# EAGLE schematic Control (EAGLE 9.5.2)

## Sheet 1 of 6
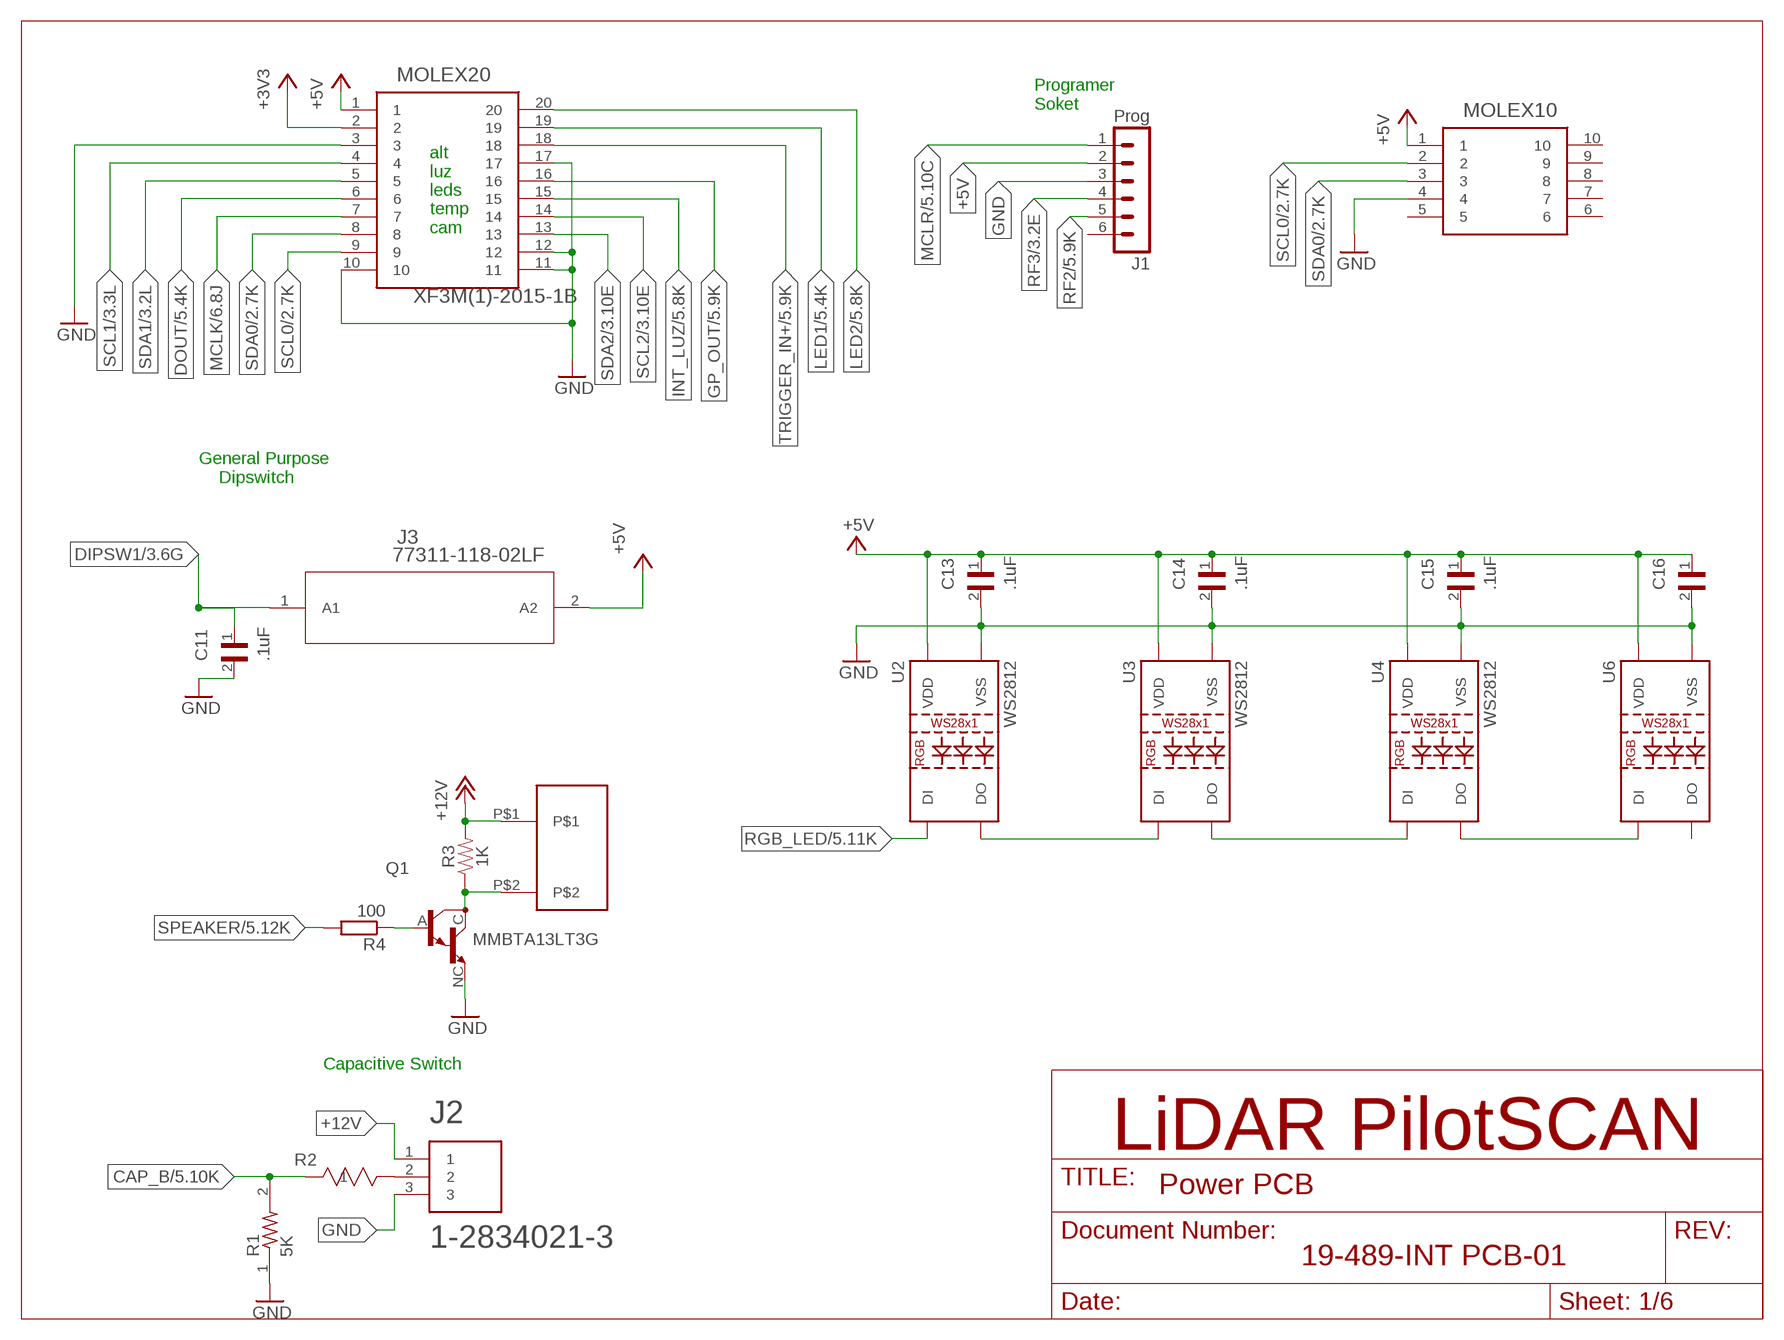
[diagram p0: schematic, sheet 1]

### Parts
BUZZ1  PS1240P02BT  [PS1240P02BT]
C11  .1uF  08056C104JAZ2A  [CAPC2012X140N]
C13  .1uF  08056C104JAZ2A  [CAPC2012X140N]
C14  .1uF  08056C104JAZ2A  [CAPC2012X140N]
C15  .1uF  08056C104JAZ2A  [CAPC2012X140N]
C16  .1uF  08056C104JAZ2A  [CAPC2012X140N]
J1  Prog  MA06-1  [MA06-1]
J2  1-2834021-3  [CONN_1-2834021-3]
J3  77311-118-02LF  [77311-118-02LF]
MOLEX10  522071060  [522071060]
MOLEX20  XF3M(1)-2015-1B  [XF3M(1)-2015-1B]
Q1  MMBTA13LT3G  [MMBTA13LT3G]
R1  5K  CRCW08055K00FKTA  [RESC2012X60]
R2  6K8  RC0201FR-076K8L  [RES_RC0201_P6XP3]
R3  1K  10MOHM-HORIZ-1/4W-5%  [AXIAL-0.3]
R4  100  RMCF0805JT270R  [RMCF0805JT270R]
U2  WS2812  WS2812"  [LED-TRICOLOR-5050-IC]
U3  WS2812  WS2812"  [LED-TRICOLOR-5050-IC]
U4  WS2812  WS2812"  [LED-TRICOLOR-5050-IC]
U6  WS2812  WS2812"  [LED-TRICOLOR-5050-IC]

### Nets
+3V3: MOLEX20.2 ; also sheet 2,3,5
+5V [power]: C13.1 C14.1 C15.1 C16.1 J1.2 J3.2(A2) MOLEX10.1 MOLEX20.1 U2.3(VDD) U2.5(VDD) U3.3(VDD) U3.5(VDD) U4.3(VDD) U4.5(VDD) U6.3(VDD) U6.5(VDD) ; also sheet 2,3,4,5,6
+12V: BUZZ1.P$1 J2.1 R3.P$2 ; also sheet 2
CAP_B: R1.2 R2.1 ; also sheet 5
DIPSW1: C11.1 J3.1(A1) ; also sheet 3
DOUT: MOLEX20.6 ; also sheet 5
GND: C11.2 C13.2 C14.2 C15.2 C16.2 J1.3 J2.3 MOLEX10.4 MOLEX20.3 MOLEX20.10 MOLEX20.11 MOLEX20.12 MOLEX20.17 Q1.NC(E) R1.1 U2.6(VSS) U3.6(VSS) U4.6(VSS) U6.6(VSS) ; also sheet 2,3,4,5,6
GP_OUT: MOLEX20.16 ; also sheet 5
INT_LUZ: MOLEX20.15 ; also sheet 5
LED1: MOLEX20.19 ; also sheet 5
LED2: MOLEX20.20 ; also sheet 5
MCLK: MOLEX20.7 ; also sheet 6
MCLR: J1.1 ; also sheet 5
N$7: Q1.A(B) R4.1
N$8: BUZZ1.P$2 Q1.C R3.P$1
N$10: J2.2 R2.2
N$47: U2.1(DO) U3.2(DI)
N$48: U3.1(DO) U4.2(DI)
N$49: U4.1(DO) U6.2(DI)
RF2: J1.5 ; also sheet 3,5
RF3: J1.4 ; also sheet 3,5
RGB_LED: U2.2(DI) ; also sheet 5
SCL0: MOLEX10.2 MOLEX20.9 ; also sheet 2,3
SCL1: MOLEX20.4 ; also sheet 3
SCL2: MOLEX20.14 ; also sheet 3
SDA0: MOLEX10.3 MOLEX20.8 ; also sheet 2,3
SDA1: MOLEX20.5 ; also sheet 3
SDA2: MOLEX20.13 ; also sheet 3
SPEAKER: R4.2 ; also sheet 5
TRIGGER_IN+: MOLEX20.18 ; also sheet 5
Unconnected: J1.6 MOLEX10.5 MOLEX10.6 MOLEX10.7 MOLEX10.8 MOLEX10.9 MOLEX10.10 U6.1(DO)

### Notes on the sheet
- Programer
  Soket
- alt
  luz
  leds
  temp
  cam
- General Purpose
      Dipswitch
- Capacitive Switch

## Sheet 2 of 6
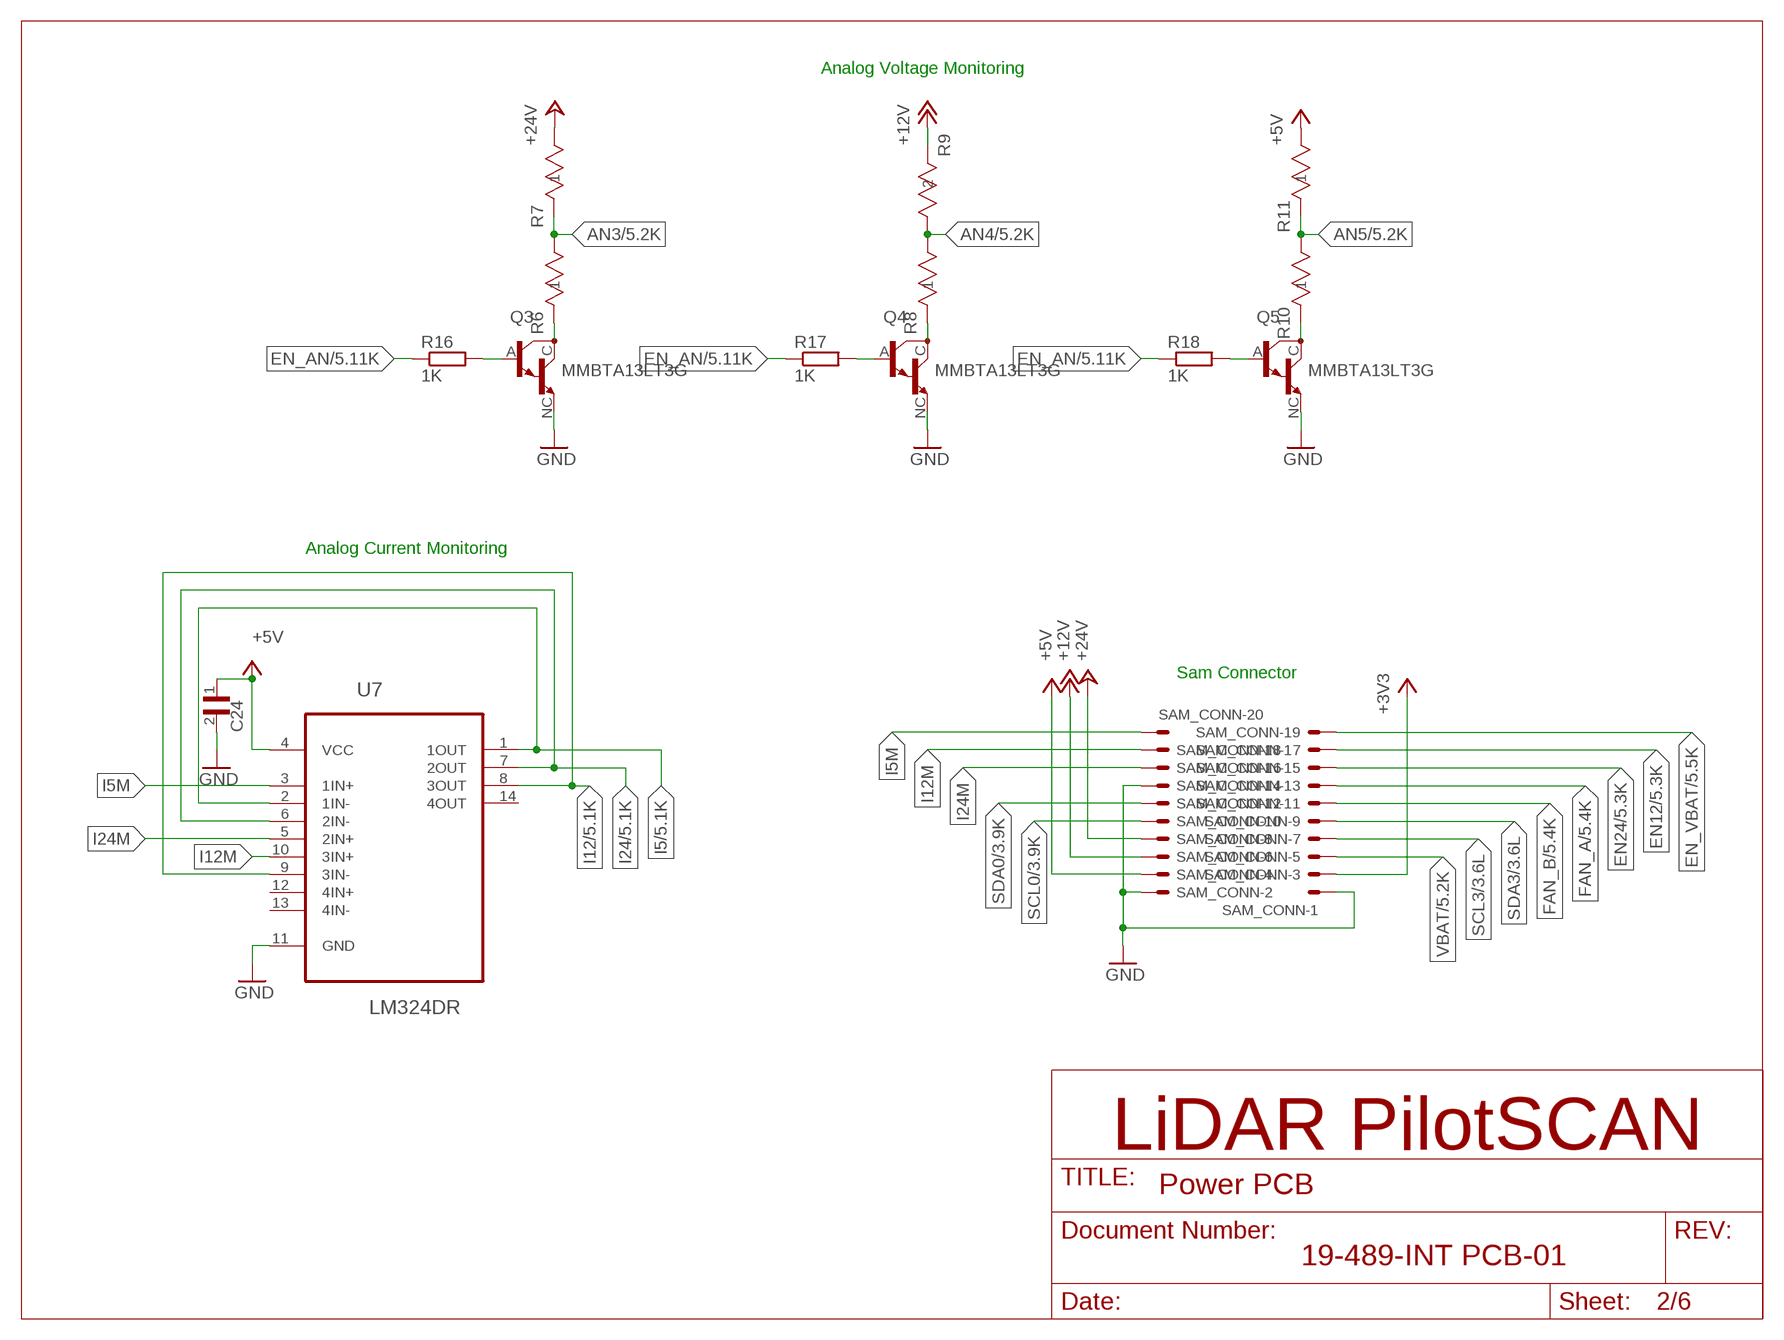
[diagram p1: schematic, sheet 2]

### Parts
C24  08056C104JAZ2A  [CAPC2012X140N]
Q3  MMBTA13LT3G  [MMBTA13LT3G]
Q4  MMBTA13LT3G  [MMBTA13LT3G]
Q5  MMBTA13LT3G  [MMBTA13LT3G]
R6  1K8  RC0201JR-071K8L  [RES_RC0201_P6XP3]
R7  18K  RC0201JR-071K8L  [RES_RC0201_P6XP3]
R8  1K8  RC0201JR-071K8L  [RES_RC0201_P6XP3]
R9  8K2  CRG0805F8K2RES0805_CRG_TYCO-L  [RES0805_CRG_TYCO-L]
R10  1K8  RC0201JR-071K8L  [RES_RC0201_P6XP3]
R11  1K5  RC0201JR-071K5L  [YAG_R0201]
R16  1K  RMCF0805FT1K00  [RMCF0805FT1K00]
R17  1K  RMCF0805FT1K00  [RMCF0805FT1K00]
R18  1K  RMCF0805FT1K00  [RMCF0805FT1K00]
SAM_CONN  IPT1-110-01-L-D  [IPT1-110-01-L-D]
U7  LM324DR  [SOIC127P600X175-14N]

### Nets
+3V3: SAM_CONN.P$3 ; also sheet 1,3,5
+5V [power]: C24.1 R11.2 SAM_CONN.P$4 U7.4(VCC) ; also sheet 1,3,4,5,6
+12V: R9.2 SAM_CONN.P$6 ; also sheet 1
+24V: R7.2 SAM_CONN.P$8
AN3: R6.2 R7.1 ; also sheet 5
AN4: R8.2 R9.1 ; also sheet 5
AN5: R10.2 R11.1 ; also sheet 5
EN12: SAM_CONN.P$17 ; also sheet 5
EN24: SAM_CONN.P$15 ; also sheet 5
EN_AN: R16.1 R17.1 R18.1 ; also sheet 5
EN_VBAT: SAM_CONN.P$19 ; also sheet 5
ESRDTFYGHUJI: Q4.C R8.1
FAN_A: SAM_CONN.P$13 ; also sheet 5
FAN_B: SAM_CONN.P$11 ; also sheet 5
GND: C24.2 Q3.NC(E) Q4.NC(E) Q5.NC(E) SAM_CONN.P$1 SAM_CONN.P$2 SAM_CONN.P$14 U7.11(GND) ; also sheet 1,3,4,5,6
I5: U7.1(1OUT) U7.2(1IN-) ; also sheet 5
I5M: SAM_CONN.P$20 U7.3(1IN+)
I12: U7.8(3OUT) U7.9(3IN-) ; also sheet 5
I12M: SAM_CONN.P$18 U7.10(3IN+)
I24: U7.6(2IN-) U7.7(2OUT) ; also sheet 5
I24M: SAM_CONN.P$16 U7.5(2IN+)
N$11: Q3.A(B) R16.2
N$37: Q3.C R6.1
N$38: Q4.A(B) R17.2
N$39: Q5.C R10.1
N$40: Q5.A(B) R18.2
SCL0: SAM_CONN.P$10 ; also sheet 1,3
SCL3: SAM_CONN.P$7 ; also sheet 3
SDA0: SAM_CONN.P$12 ; also sheet 1,3
SDA3: SAM_CONN.P$9 ; also sheet 3
VBAT: SAM_CONN.P$5 ; also sheet 5
Unconnected: U7.12(4IN+) U7.13(4IN-) U7.14(4OUT)

### Notes on the sheet
- Analog Voltage Monitoring
- Analog Current Monitoring
- Sam Connector

## Sheet 3 of 6
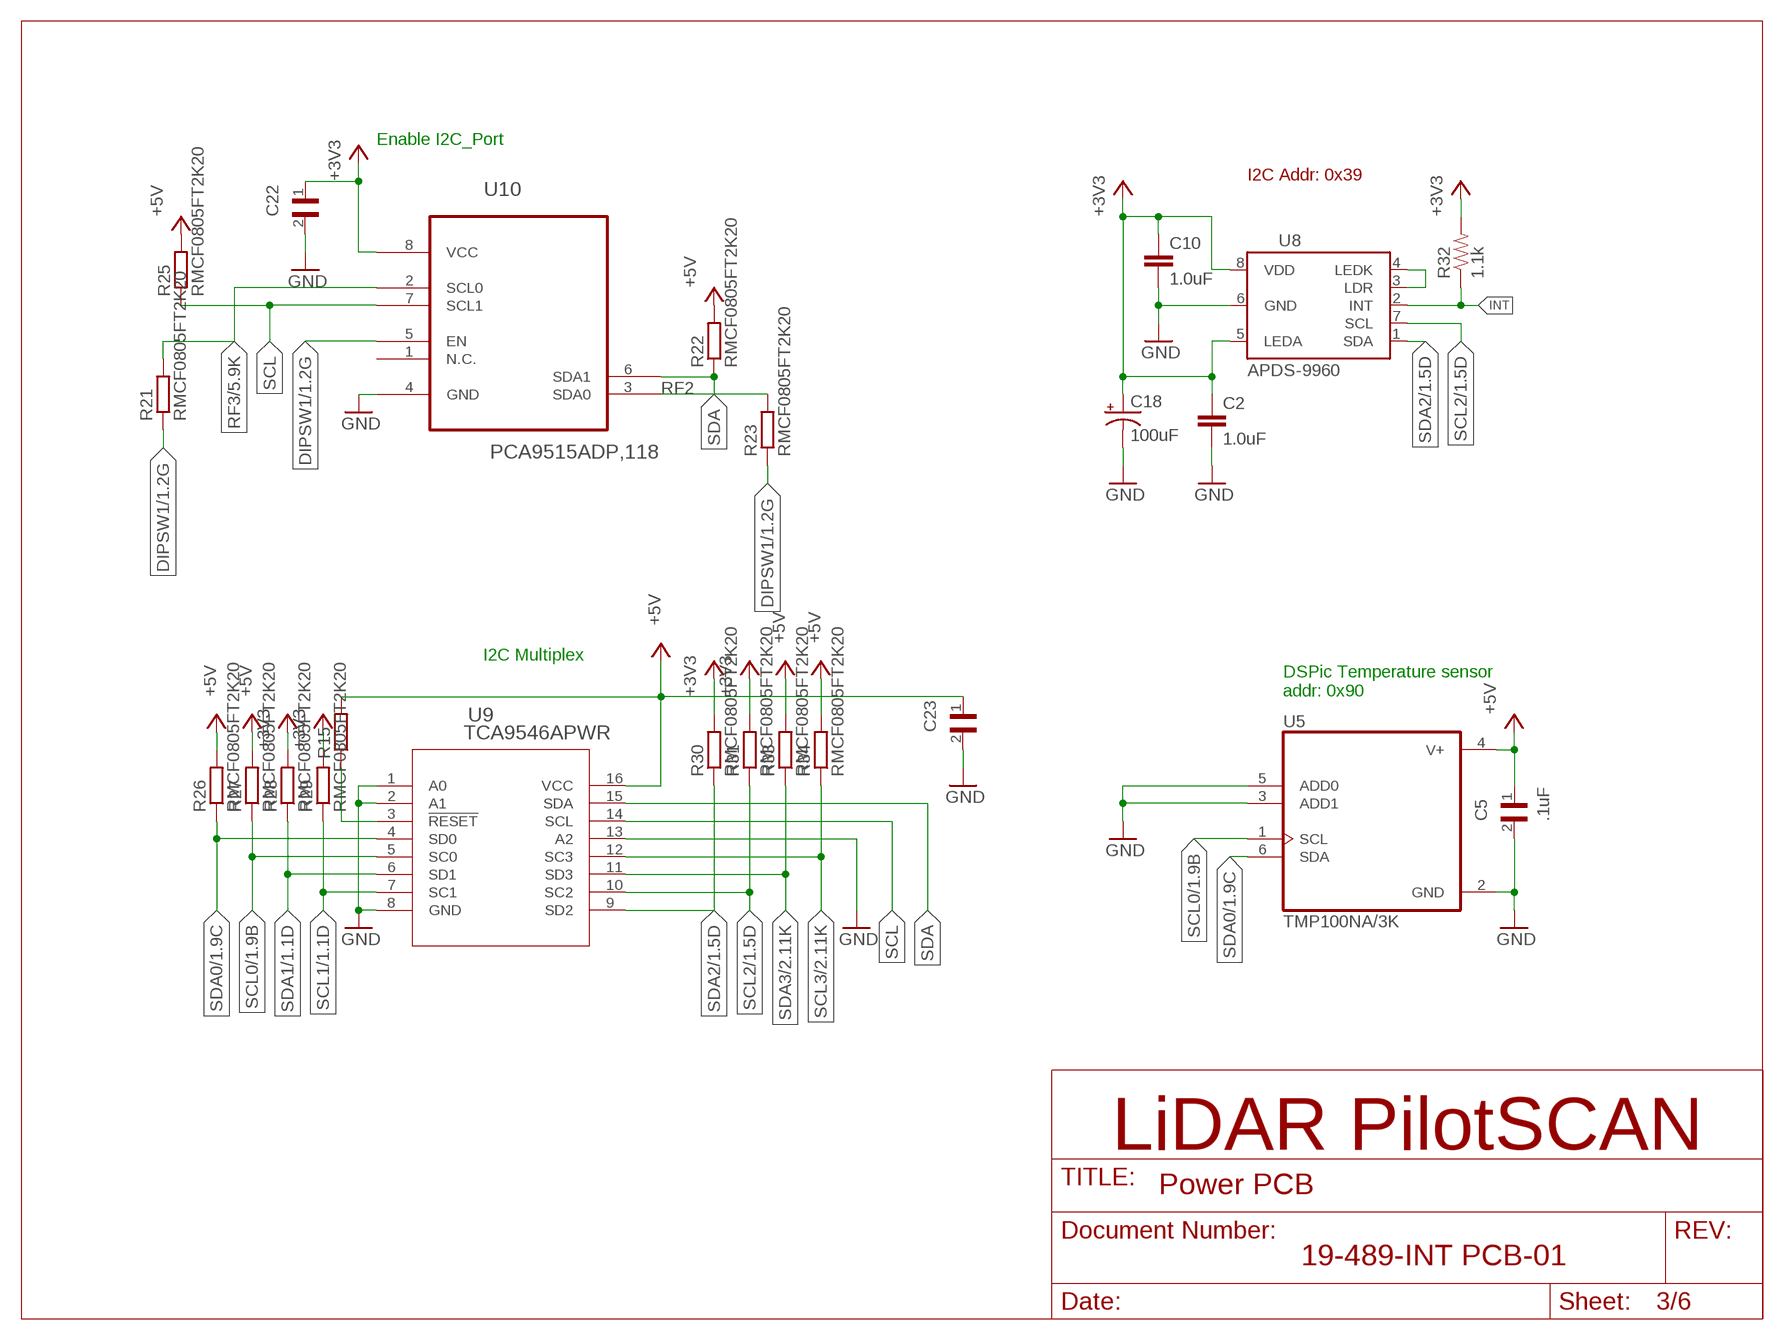
[diagram p2: schematic, sheet 3]

### Parts
C2  1.0uF  1.0UF-16V-10%(0603)  [0603-CAP]
C5  .1uF  08056C104JAZ2A  [CAPC2012X140N]
C10  1.0uF  1.0UF-16V-10%(0603)  [0603-CAP]
C18  100uF  100UF-10V-10%(TANT)  [EIA7343]
C22  08056C104JAZ2A  [CAPC2012X140N]
C23  08056C104JAZ2A  [CAPC2012X140N]
R15  RMCF0805FT2K20  [RMCF0805FT2K20]
R21  RMCF0805FT2K20  [RMCF0805FT2K20]
R22  RMCF0805FT2K20  [RMCF0805FT2K20]
R23  RMCF0805FT2K20  [RMCF0805FT2K20]
R25  RMCF0805FT2K20  [RMCF0805FT2K20]
R26  RMCF0805FT2K20  [RMCF0805FT2K20]
R27  RMCF0805FT2K20  [RMCF0805FT2K20]
R28  RMCF0805FT2K20  [RMCF0805FT2K20]
R29  RMCF0805FT2K20  [RMCF0805FT2K20]
R30  RMCF0805FT2K20  [RMCF0805FT2K20]
R31  RMCF0805FT2K20  [RMCF0805FT2K20]
R32  1.1k  10KOHM1/10W1%(0603)0603  [0603-RES]
R33  RMCF0805FT2K20  [RMCF0805FT2K20]
R34  RMCF0805FT2K20  [RMCF0805FT2K20]
U5  TMP100NA/3K  [TMP100NA/3K]
U8  APDS-9960  [APDS-9960]
U9  TCA9546APWR  [PW16]
U10  PCA9515ADP,118  [SOP65P490X110-8N]

### Nets
+3V3: C2.1 C10.1 C18.A(+) C22.1 R28.2 R29.2 R30.2 R31.2 R32.2 U8.5(LEDA) U8.8(VDD) U10.8(VCC) ; also sheet 1,2,5
+5V [power]: C5.1 C23.1 R15.2 R22.2 R25.2 R26.2 R27.2 R33.2 R34.2 U5.4(V+) U9.16(VCC) ; also sheet 1,2,4,5,6
DIPSW1: R21.1 R23.1 U10.5(EN) ; also sheet 1
GND: C2.2 C5.2 C10.2 C18.C(-) C22.2 C23.2 U5.2(GND) U5.3(ADD1) U5.5(ADD0) U8.6(GND) U9.1(A0) U9.2(A1) U9.8(GND) U9.13(A2) U10.4(GND) ; also sheet 1,2,4,5,6
INT: R32.1 U8.2(INT)
N$12: U8.3(LDR) U8.4(LEDK)
N$31: R15.1 U9.3(!RESET)
RF2: R23.2 U10.3(SDA0) ; also sheet 1,5
RF3: R21.2 U10.2(SCL0) ; also sheet 1,5
SCL: R25.1 U9.14(SCL) U10.7(SCL1)
SCL0: R27.1 U5.1(SCL) U9.5(SC0) ; also sheet 1,2
SCL1: R29.1 U9.7(SC1) ; also sheet 1
SCL2: R31.1 U8.7(SCL) U9.10(SC2) ; also sheet 1
SCL3: R34.1 U9.12(SC3) ; also sheet 2
SDA: R22.1 U9.15(SDA) U10.6(SDA1)
SDA0: R26.1 U5.6(SDA) U9.4(SD0) ; also sheet 1,2
SDA1: R28.1 U9.6(SD1) ; also sheet 1
SDA2: R30.1 U8.1(SDA) U9.9(SD2) ; also sheet 1
SDA3: R33.1 U9.11(SD3) ; also sheet 2
Unconnected: U10.1(N.C.)

### Notes on the sheet
- Enable I2C_Port
- I2C Addr: 0x39
- I2C Multiplex
- DSPic Temperature sensor
  addr: 0x90

## Sheet 4 of 6
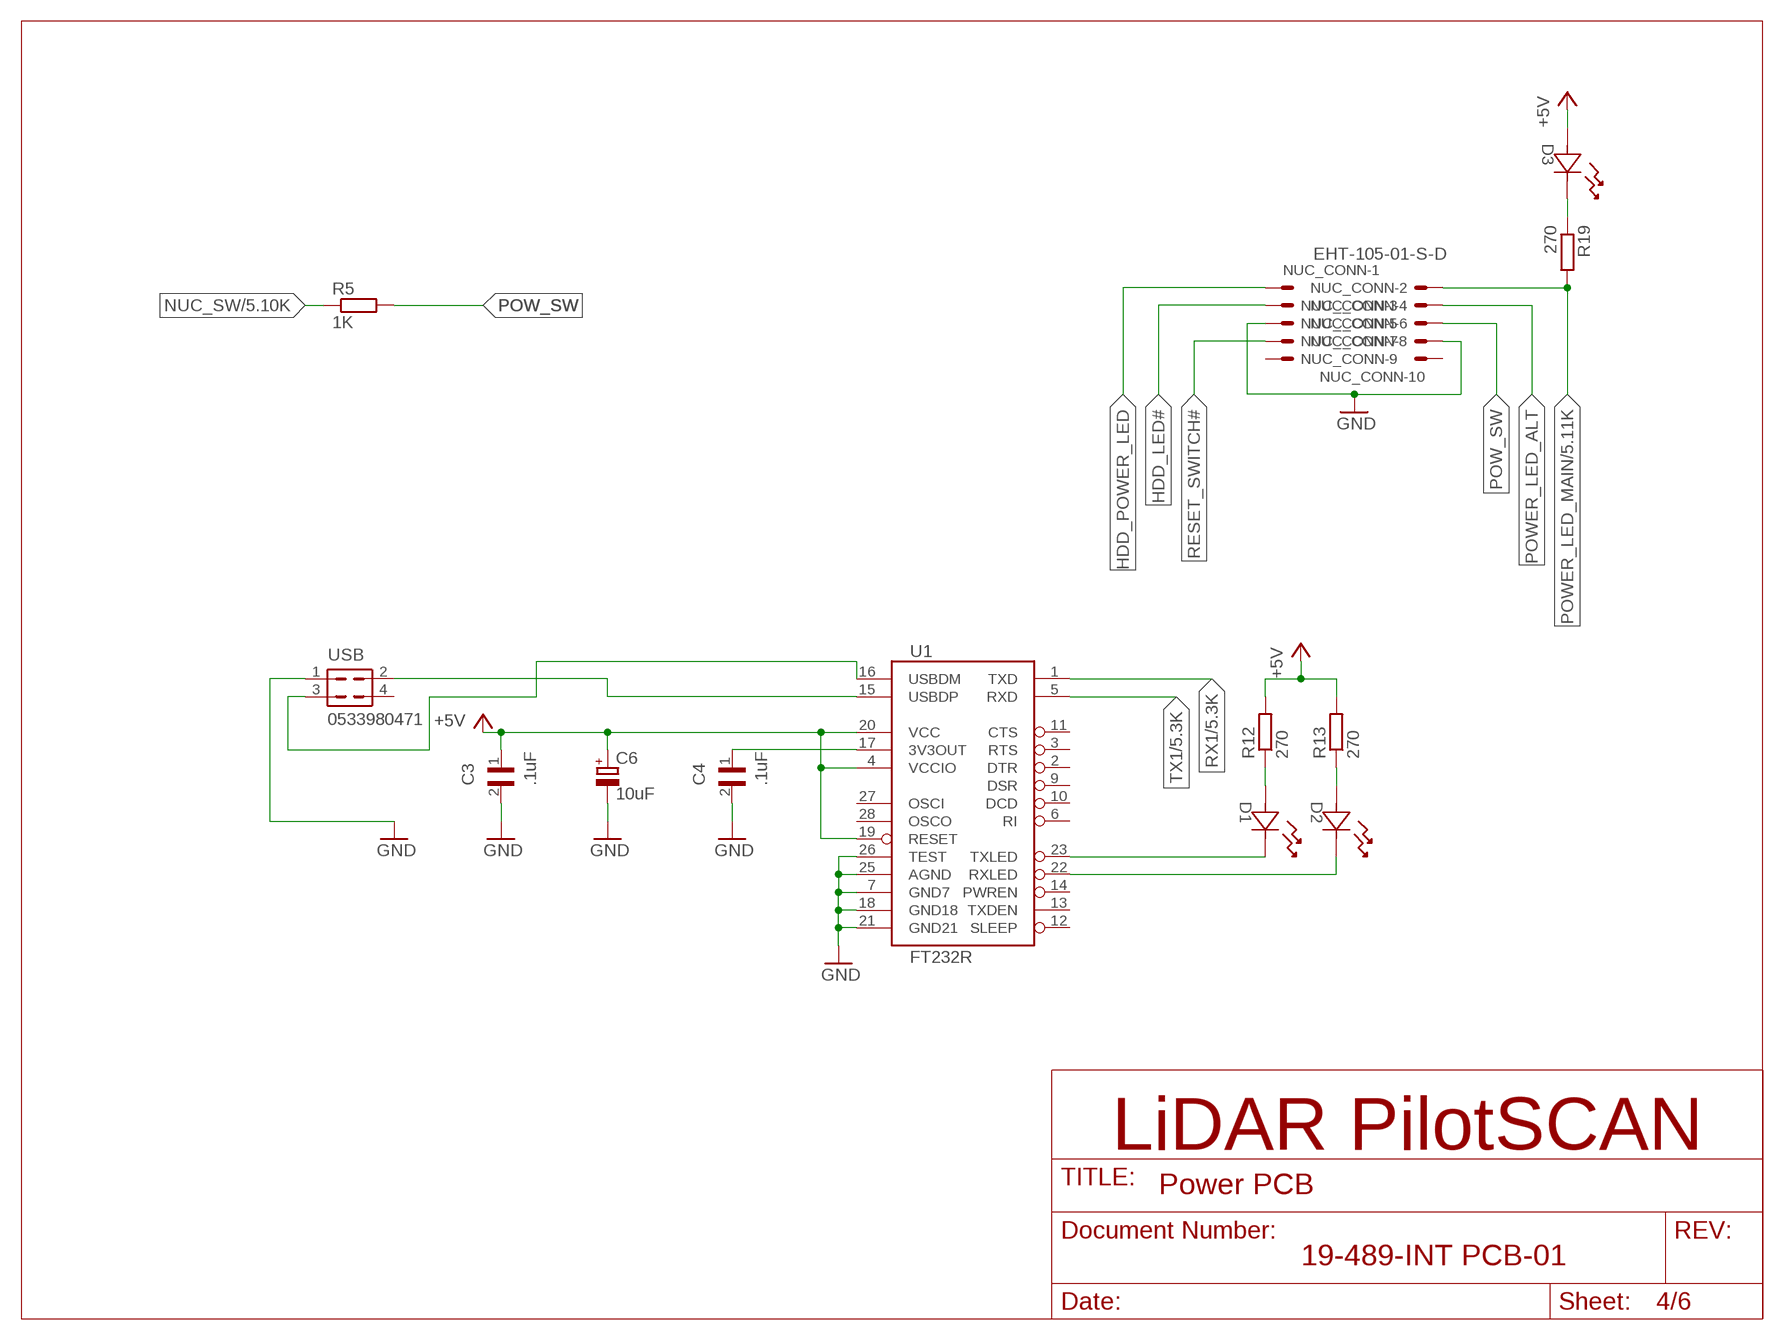
[diagram p3: schematic, sheet 4]

### Parts
C3  .1uF  08056C104JAZ2A  [CAPC2012X140N]
C4  .1uF  08056C104JAZ2A  [CAPC2012X140N]
C6  10uF  CPOL-EUE1.8-4  [E1,8-4]
D1  TLMS1100-GS08  [LED_VISHAY_TLMX1100]
D2  TLMS1100-GS08  [LED_VISHAY_TLMX1100]
D3  TLMS1100-GS08  [LED_VISHAY_TLMX1100]
NUC_CONN  EHT-105-01-S-D  [332-10]
R5  1K  RMCF0805FT1K00  [RMCF0805FT1K00]
R12  270  RMCF0805JT270R  [RMCF0805JT270R]
R13  270  RMCF0805JT270R  [RMCF0805JT270R]
R19  270  RMCF0805JT270R  [RMCF0805JT270R]
U1  FT232R  FT232RLSSOP  [SSOP28DB]
USB  0533980471  [0533980471]

### Nets
+5V [power]: C3.1 C6.+ D3.2 R12.2 R13.2 U1.4(VCCIO) U1.19(RESET) U1.20(VCC) ; also sheet 1,2,3,5,6
GND: C3.2 C4.2 C6.- NUC_CONN.5 NUC_CONN.8 U1.7(GND7) U1.18(GND18) U1.21(GND21) U1.25(AGND) U1.26(TEST) USB.1 ; also sheet 1,2,3,5,6
HDD_LED#: NUC_CONN.3
HDD_POWER_LED: NUC_CONN.1
N$1: D1.2 R12.1
N$4 [power]: C4.1 U1.17(3V3OUT)
N$5: D2.2 R13.1
N$6: D3.1 R19.1
N$9: U1.15(USBDP) USB.2
N$13: U1.16(USBDM) USB.3
NUC_SW: R5.1 ; also sheet 5
POW_SW: NUC_CONN.6 R5.2
POWER_LED_ALT: NUC_CONN.4
POWER_LED_MAIN: NUC_CONN.2 R19.2 ; also sheet 5
RESET_SWITCH#: NUC_CONN.7
RX1: U1.1(TXD) ; also sheet 5
RXLED: D2.1 U1.22(RXLED)
TX1: U1.5(RXD) ; also sheet 5
TXLED: D1.1 U1.23(TXLED)
Unconnected: NUC_CONN.9 NUC_CONN.10 U1.2(DTR) U1.3(RTS) U1.6(RI) U1.9(DSR) U1.10(DCD) U1.11(CTS) U1.12(SLEEP) U1.13(TXDEN) U1.14(PWREN) U1.27(OSCI) U1.28(OSCO) USB.4

## Sheet 5 of 6
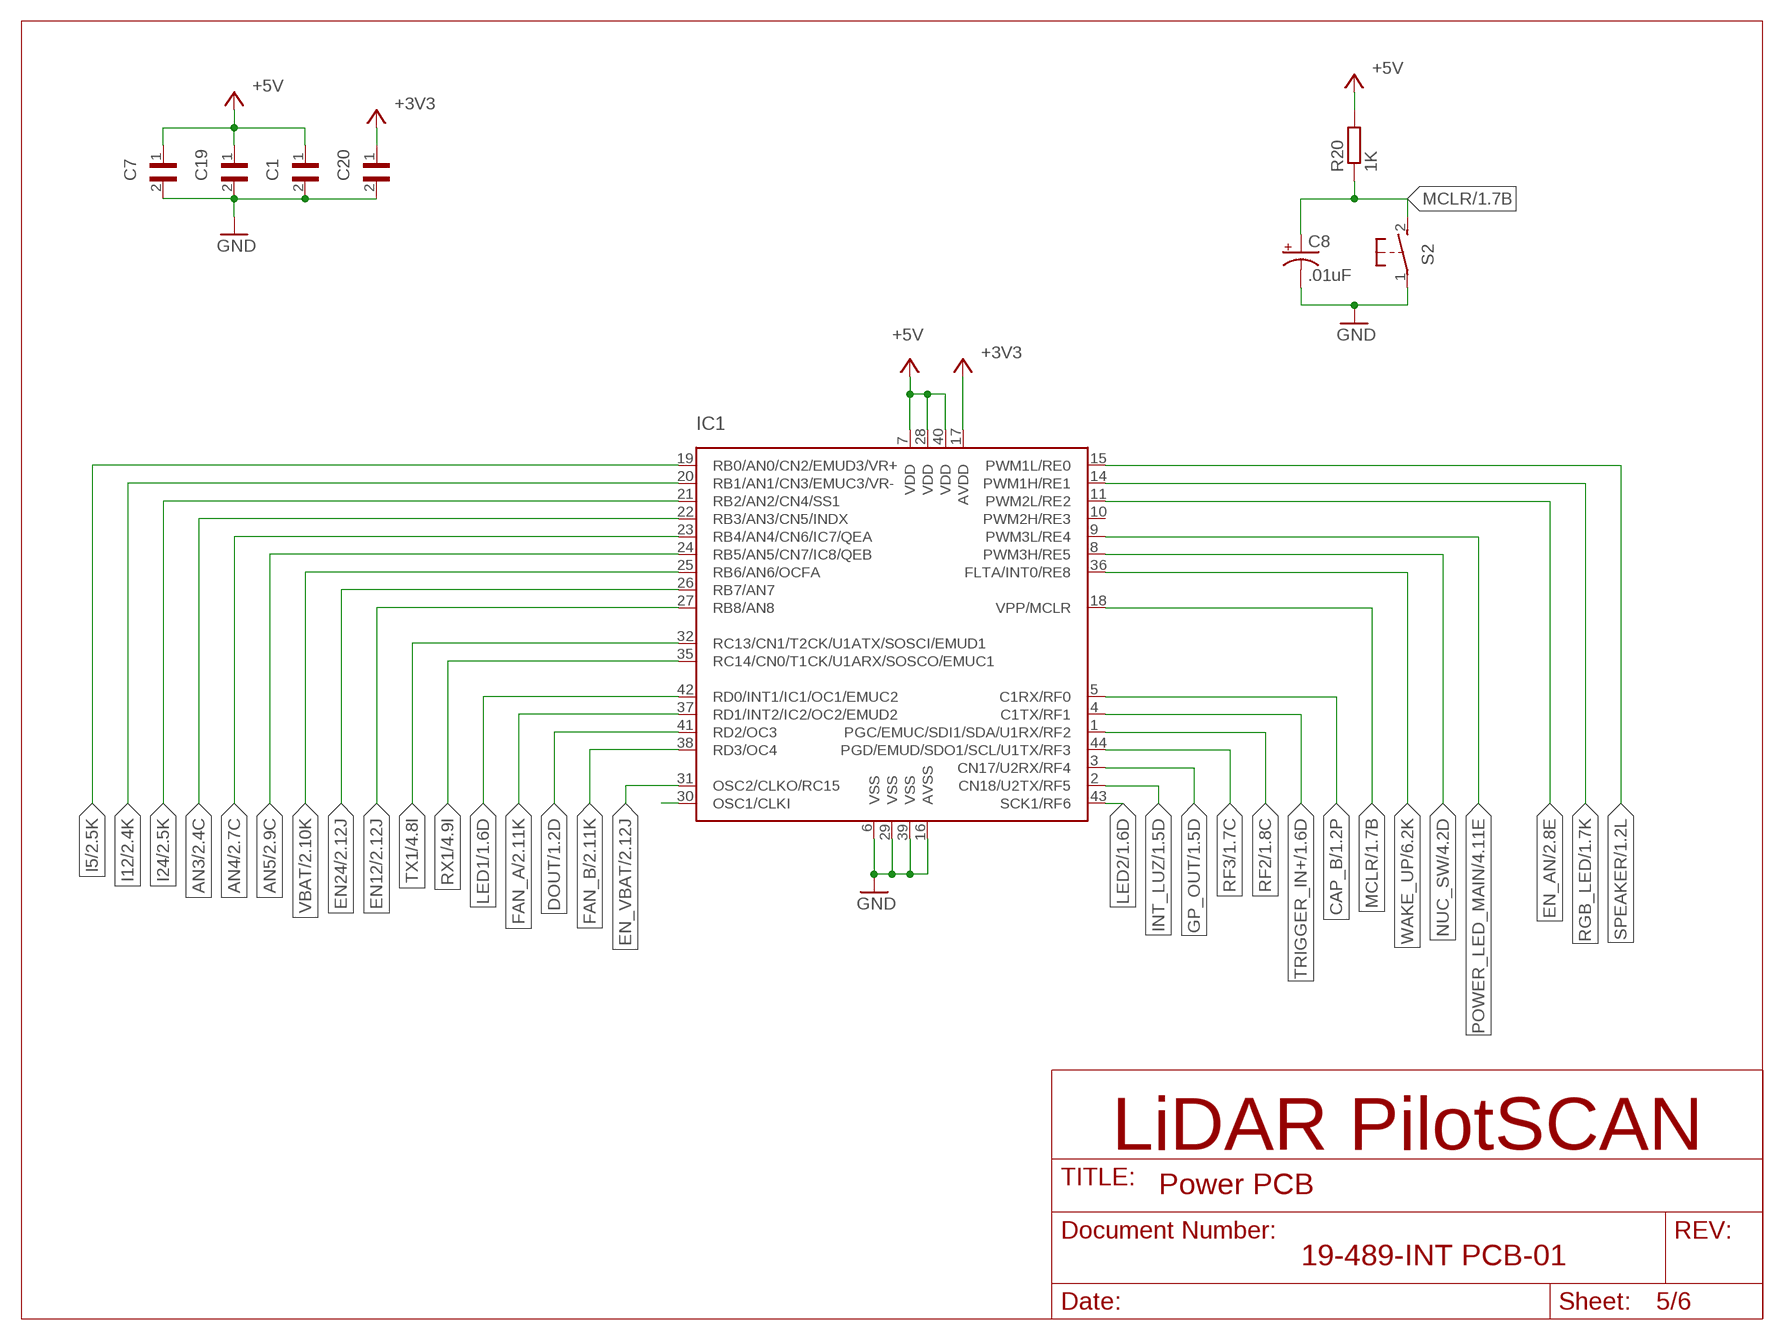
[diagram p4: schematic, sheet 5]

### Parts
C1  08056C104JAZ2A  [CAPC2012X140N]
C7  08056C104JAZ2A  [CAPC2012X140N]
C8  .01uF  CL03A104KQ3NNNC  [CL03A104KQ3NNNC]
C19  08056C104JAZ2A  [CAPC2012X140N]
C20  08056C104JAZ2A  [CAPC2012X140N]
IC1  DSPIC30F4011/PT  [TQFP44]
R20  1K  RMCF0805FT1K00  [RMCF0805FT1K00]
S2  DTSM-3  [DTSM-3]

### Nets
+3V3: C20.1 IC1.17(AVDD) ; also sheet 1,2,3
+5V [power]: C1.1 C7.1 C19.1 IC1.7(VDD) IC1.28(VDD) IC1.40(VDD) R20.2 ; also sheet 1,2,3,4,6
AN3: IC1.22(RB3/AN3/CN5/INDX) ; also sheet 2
AN4: IC1.23(RB4/AN4/CN6/IC7/QEA) ; also sheet 2
AN5: IC1.24(RB5/AN5/CN7/IC8/QEB) ; also sheet 2
CAP_B: IC1.5(C1RX/RF0) ; also sheet 1
DOUT: IC1.41(RD2/OC3) ; also sheet 1
EN12: IC1.27(RB8/AN8) ; also sheet 2
EN24: IC1.26(RB7/AN7) ; also sheet 2
EN_AN: IC1.11(PWM2L/RE2) ; also sheet 2
EN_VBAT: IC1.31(OSC2/CLKO/RC15) ; also sheet 2
FAN_A: IC1.37(RD1/INT2/IC2/OC2/EMUD2) ; also sheet 2
FAN_B: IC1.38(RD3/OC4) ; also sheet 2
GND: C1.2 C7.2 C8.2(-) C19.2 C20.2 IC1.6(VSS) IC1.16(AVSS) IC1.29(VSS) IC1.39(VSS) S2.1 ; also sheet 1,2,3,4,6
GP_OUT: IC1.3(CN17/U2RX/RF4) ; also sheet 1
I5: IC1.19(RB0/AN0/CN2/EMUD3/VR+) ; also sheet 2
I12: IC1.20(RB1/AN1/CN3/EMUC3/VR-) ; also sheet 2
I24: IC1.21(RB2/AN2/CN4/SS1) ; also sheet 2
INT_LUZ: IC1.2(CN18/U2TX/RF5) ; also sheet 1
LED1: IC1.42(RD0/INT1/IC1/OC1/EMUC2) ; also sheet 1
LED2: IC1.43(SCK1/RF6) ; also sheet 1
MCLR: C8.1(+) IC1.18(VPP/MCLR) R20.1 S2.2 ; also sheet 1
N$2: IC1.30(OSC1/CLKI)
NUC_SW: IC1.8(PWM3H/RE5) ; also sheet 4
POWER_LED_MAIN: IC1.9(PWM3L/RE4) ; also sheet 4
RF2: IC1.1(PGC/EMUC/SDI1/SDA/U1RX/RF2) ; also sheet 1,3
RF3: IC1.44(PGD/EMUD/SDO1/SCL/U1TX/RF3) ; also sheet 1,3
RGB_LED: IC1.14(PWM1H/RE1) ; also sheet 1
RX1: IC1.35(RC14/CN0/T1CK/U1ARX/SOSCO/EMUC1) ; also sheet 4
SPEAKER: IC1.15(PWM1L/RE0) ; also sheet 1
TRIGGER_IN+: IC1.4(C1TX/RF1) ; also sheet 1
TX1: IC1.32(RC13/CN1/T2CK/U1ATX/SOSCI/EMUD1) ; also sheet 4
VBAT: IC1.25(RB6/AN6/OCFA) ; also sheet 2
WAKE_UP: IC1.36(FLTA/INT0/RE8) ; also sheet 6
Unconnected: IC1.10(PWM2H/RE3)

## Sheet 6 of 6
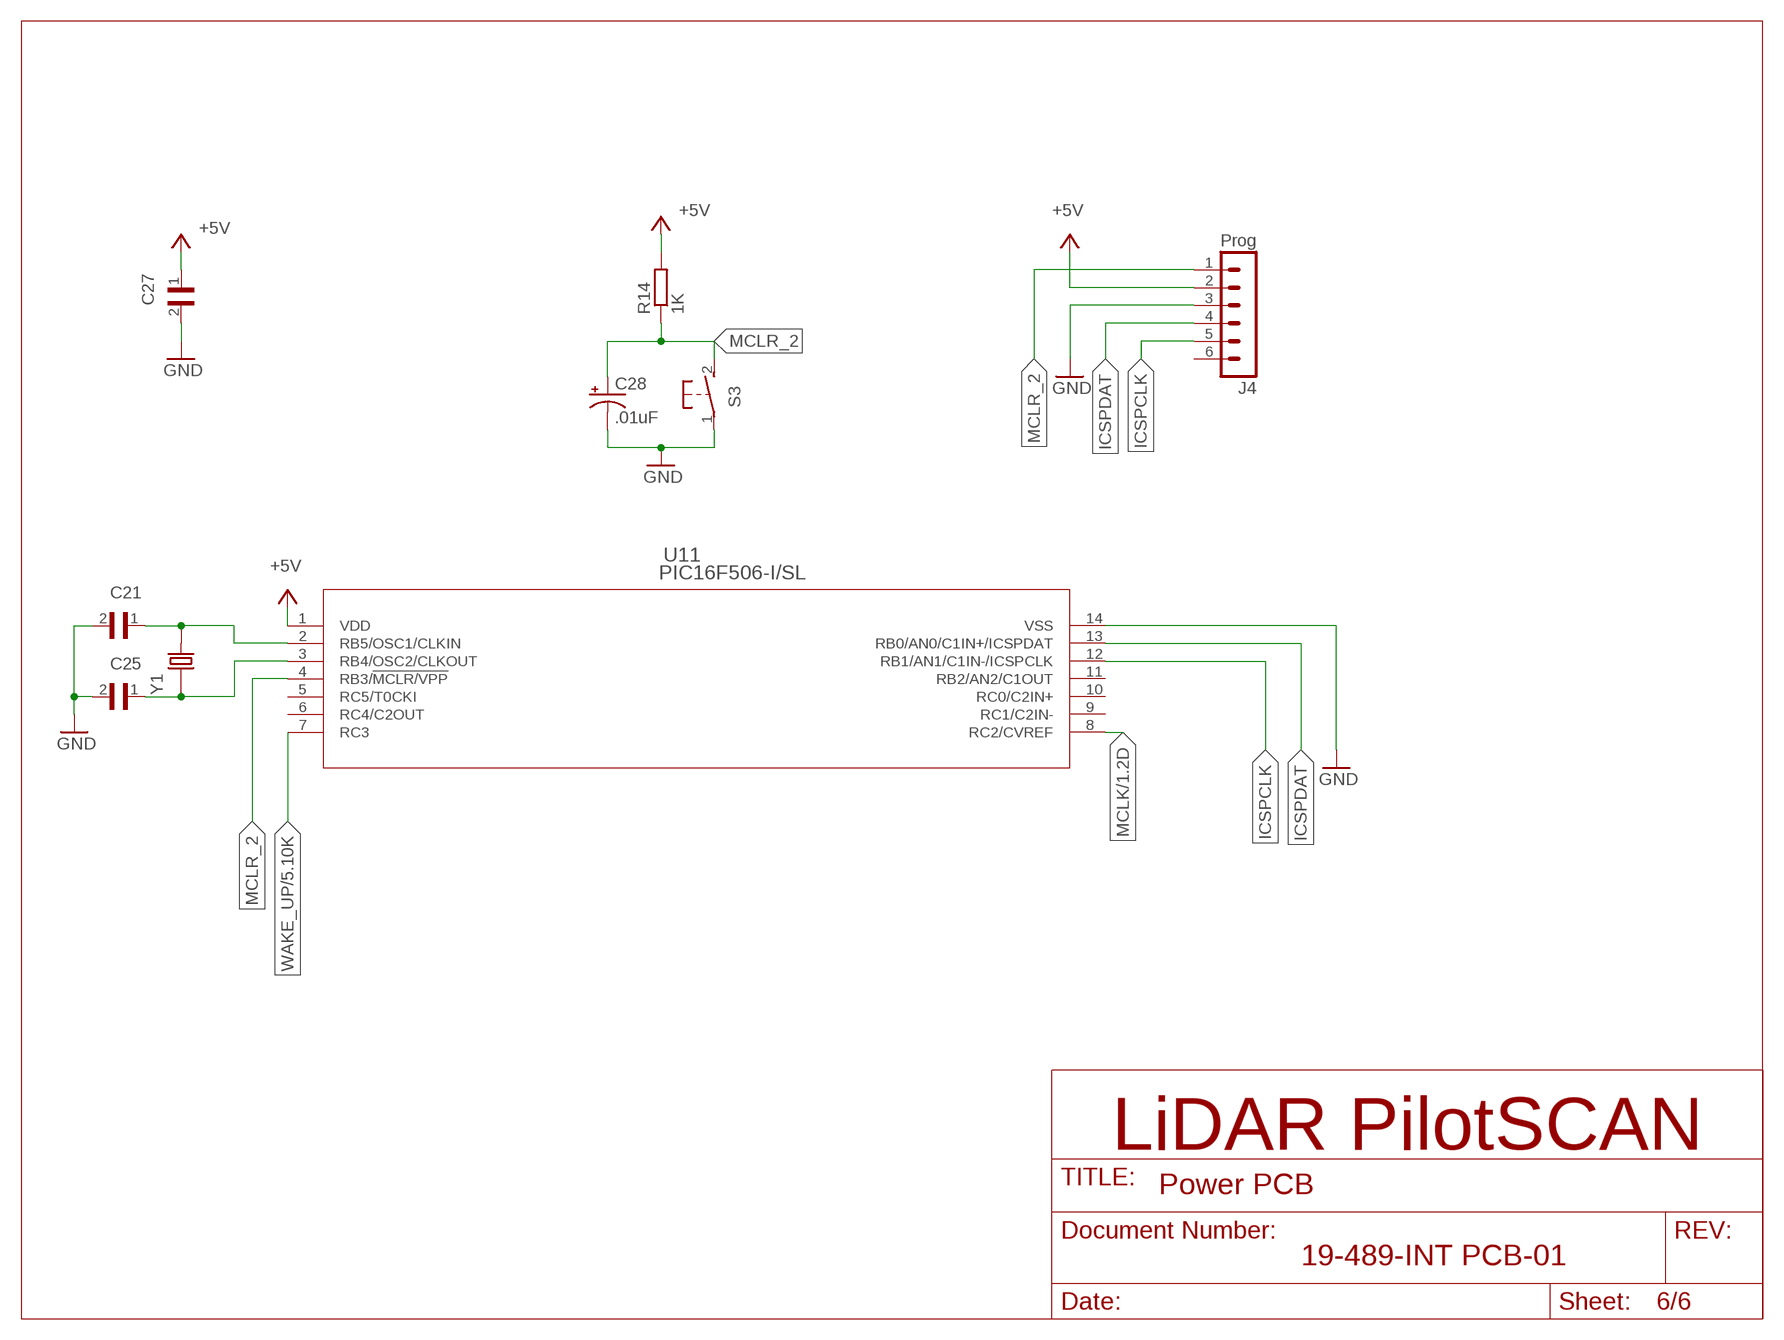
[diagram p5: schematic, sheet 6]

### Parts
C21  C0603C150M8GACTU  [CAPC1608X90]
C25  C0603C150M8GACTU  [CAPC1608X90]
C27  08056C104JAZ2A  [CAPC2012X140N]
C28  .01uF  CL03A104KQ3NNNC  [CL03A104KQ3NNNC]
J4  Prog  MA06-1  [MA06-1]
R14  1K  RMCF0805FT1K00  [RMCF0805FT1K00]
S3  DTSM-3  [DTSM-3]
U11  PIC16F506-I/SL  [SOIC14-N_MC]
Y1  ECS-10-13-1XH  [XTAL_ECS-10-13-1XH]

### Nets
+5V [power]: C27.1 J4.2 R14.2 U11.1(VDD) ; also sheet 1,2,3,4,5
GND: C21.2 C25.2 C27.2 C28.2(-) J4.3 S3.1 U11.14(VSS) ; also sheet 1,2,3,4,5
ICSPCLK: J4.5 U11.12(RB1/AN1/C1IN-/ICSPCLK)
ICSPDAT: J4.4 U11.13(RB0/AN0/C1IN+/ICSPDAT)
MCLK: U11.8(RC2/CVREF) ; also sheet 1
MCLR_2: C28.1(+) J4.1 R14.1 S3.2 U11.4(RB3/!MCLR/VPP)
N$28: C21.1 U11.2(RB5/OSC1/CLKIN) Y1.2
N$29: C25.1 U11.3(RB4/OSC2/CLKOUT) Y1.1
WAKE_UP: U11.7(RC3) ; also sheet 5
Unconnected: J4.6 U11.5(RC5/T0CKI) U11.6(RC4/C2OUT) U11.9(RC1/C2IN-) U11.10(RC0/C2IN+) U11.11(RB2/AN2/C1OUT)

## Library data of the parts
BUZZ1 = PS1240P02BT:PS1240P02BT; AVAILABILITY: Unavailable; DESCRIPTION: Audio Buzzer Piezo 30Vo-p 3Vo-p 70dBA Pin Through Hole T/R; MF: TDK; MP: PS1240P02BT; PACKAGE: 2020 TDK; PRICE: None
C1 C3-C5 C7 C11 C13-C16 C19 C20 C22-C24 C27 = 08056C104JAZ2A:08056C104JAZ2A: Cap Ceramic 0.1uF 6.3V X7R 5% SMD 0805 FlexiTerm 125°C T/R; AVAILABILITY: Unavailable; DESCRIPTION: 0805 100 nF 6.3 V ±5 % Tolerance X7R SMT Multilayer Ceramic Capacitor; MF: AVX; MP: 08056C104JAZ2A; PACKAGE: 0805 AVX; PRICE: None
C2 C10 = SparkFun-Capacitors:1.0UF-16V-10%(0603): CAP-00868; PROD_ID: CAP-00868
C6 = resistor:CPOL-EU: POLARIZED CAPACITOR, European symbol
C8 C28 = CL03A104KQ3NNNC:CL03A104KQ3NNNC
C18 = SparkFun-Capacitors:100UF-10V-10%(TANT): CAP-07890; PROD_ID: CAP-07890
C21 C25 = C0603C150M8GACTU:C0603C150M8GACTU: Cap Ceramic 15pF 10V C0G 20% SMD 0603 Paper T/R; DESCRIPTION: Cap Ceramic 15pF 10V C0G 20% SMD 0603 Paper T/R; DIGI-KEY_PART_NUMBER: 399-9005-1-ND; DIGI-KEY_PURCHASE_URL: https://www.digikey.com/product-detail/en/kemet/C0603C150M8GACTU/399-9005-1-ND/3522522?utm_source=snapeda&utm_medium=aggregator&utm_campaign=symbol; MF: KEMET; MP: C0603C150M8GACTU; PACKAGE: 0603 Kemet
D1-D3 = TLMS1100-GS08:TLMS1100-GS08; MANUFACTURER_PART_NUMBER: TLMS1100GS08; VENDOR: Vishay
IC1 = microchip-dspic:DSPIC30F4011: dsPIC Motion Controller DSC
J1 J4 = con-lstb:MA06-1: PIN HEADER; OC_FARNELL: unknown; OC_NEWARK: unknown
J2 = 1-2834021-3:1-2834021-3: Conn PC Terminal Block RCP 3 POS 2.5mm Solder ST Thru-Hole 5A/Contact Box/Carton; COMMENT: 1-2834021-3; DESCRIPTION: Conn PC Terminal Block RCP 3 POS 2.5mm Solder ST Thru-Hole 5A/Contact Box/Carton; DIGI-KEY_PART_NUMBER: A123845-ND; DIGI-KEY_PURCHASE_URL: https://www.digikey.com/product-detail/en/te-connectivity-amp-connectors/1-2834021-3/A123845-ND/5872961?utm_source=snapeda&utm_medium=aggregator&utm_campaign=symbol; MF: TE Connectivity; MP: 1-2834021-3; PACKAGE: None; TE_PURCHASE_URL: https://www.te.com/usa-en/product-1-2834021-3.html?te_bu=Cor&te_type=disp&te_campaign=seda_glo_cor-seda-global-disp-prtnr-fy19-seda-model-bom-cta_sma-317_1&elqCampaignId=32493
J3 = 77311-118-02LF:77311-118-02LF; MANUFACTURER_PART_NUMBER: 7731111802LF; VENDOR: Amphenol FCI
MOLEX10 = 522071060:522071060: SOCKET FPC, SMT, 1MM, 14 WAY; AVAILABILITY: Unavailable; DESCRIPTION: 1.00mm FFC/FPC Connectors HSG ASSY ZIF SMT 14P; MF: Molex; MP: 52207-1485; PACKAGE: None; PRICE: None
MOLEX20 = XF3M(1)-2015-1B:XF3M(1)-2015-1B: SOCKET FPC, SMT, 1MM, 14 WAY; AVAILABILITY: Unavailable; DESCRIPTION: 1.00mm FFC/FPC Connectors HSG ASSY ZIF SMT 14P; MF: Molex; MP: 52207-1485; PACKAGE: None; PRICE: None
NUC_CONN = EHT-105-01-S-D:EHT-105-01-S-D: 10 Pin - 2mm Dual Row Source: www.mpe-connector.de / garry_shortform_2012.pdf
Q1 Q3-Q5 = MMBTA13LT3G:MMBTA13LT3G: Trans Darlington NPN 30V 0.3A 3-Pin SOT-23 T/R
R1 = CRCW08055K00FKTA:CRCW08055K00FKTA: RES, THICK FILM, 5K, 1%, 0.125W, 0805, R; DESCRIPTION: Res Thick Film 0805 5K Ohm 1% 1/8W ±100ppm/°C Molded SMD SMD Paper T/R; DIGI-KEY_PART_NUMBER: 541-4321-1-ND; DIGI-KEY_PURCHASE_URL: https://www.digikey.com.co/product-detail/en/vishay-dale/CRCW08055K00FKTA/541-4321-1-ND/8565934?utm_source=snapeda&utm_medium=aggregator&utm_campaign=symbol; MF: Vishay; MP: CRCW08055K00FKTA; PACKAGE: 0805 Vishay
R2 = RC0201FR-076K8L:RC0201FR-076K8L; MANUFACTURER_PART_NUMBER: RC0201FR076K8L; VENDOR: Yageo
R3 = SparkFun-Resistors:10MOHM: RES-09327; PROD_ID: RES-09327; VALUE: 10M
R4 R12 R13 R19 = RMCF0805JT270R:RMCF0805JT270R
R5 R14 R16-R18 R20 = RMCF0805FT1K00:RMCF0805FT1K00
R6 R8 R10 = RC0201JR-071K8L:RC0201JR-071K8L; MANUFACTURER_PART_NUMBER: RC0201JR071K8L; VENDOR: Yageo
R7 = RMCF0603JT18K0:RC0201JR-071K8L; MANUFACTURER_PART_NUMBER: RC0201JR071K8L; VENDOR: Yageo
R9 = CRG0805F8K2:CRG0805F8K2; MANUFACTURER_PART_NUMBER: CRG0805F8K2; VENDOR: TE Connectivity
R11 = RC0201JR-071K5L:RC0201JR-071K5L; MANUFACTURER_PART_NUMBER: RC0201JR071K5L; VENDOR: Yageo
R15 R21-R23 R25-R31 R33 R34 = RMCF0805FT2K20:RMCF0805FT2K20
R32 = SparkFun-Resistors:10KOHM1/10W1%(0603): RES-00824; PROD_ID: RES-00824; VALUE: 10K
S2 S3 = switch-tact:DTSM-3
SAM_CONN = IPT-110-01-L-D:IPT1-110-01-L-D: 20 Pin - 2mm Dual Row Source: www.mpe-connector.de / garry_shortform_2012.pdf
U1 = SparkFun:FT232RL: USB UART FT232RL 4th Generation USB UART (USB <-> Serial) Controller. Spark Fun Electronics SKU : COM-00650
U2-U4 U6 = SparkFun-LED:WS2812: WS2812 RGB LED w/ WS2811 driver 5x5mm SMD LED with built-in controller IC. Color: Red/Green/Blue mC Rating: RGB: 550, 1100, 200 mcd Current:RGB: 20, 20, 20 mA Forward Voltage: RGB: 1.8, 3.0, 3.2 V Packages:LED-TRICOLOR-5050-IC SparkFun Products: LED-SMD RGB (WS2812) <https://www.sparkfun.com/products/11821>; PROD_ID: DIO-11598
U5 = TMP100NA_3K:TMP100NA/3K: Digital Temperature Sensor with I2C Interface; AVAILABILITY: Unavailable; DESCRIPTION: Temperature Sensor with I2C/SMBus Interface in SOT-23 6-SOT-23 -55 to 125; MF: Texas Instruments; MP: TMP100NA/3K; PACKAGE: SOT-23 Texas Instruments; PRICE: None
U7 = LM324DR:LM324DR: QUADRUPLE OPERATIONAL AMPLIFIERS; AVAILABILITY: Unavailable; DESCRIPTION: Quadruple Operational Amplifier 14-SOIC 0 to 70; MF: Texas Instruments; MP: LM324DR; PACKAGE: SOIC-14 Texas Instruments; PRICE: None; SPICEPREFIX: X
U8 = SparkFun-Sensors:APDS-9960: Avago APDS-9960 digital proximity, ambient light, RGB, and gesture sensor.; PROD_ID: SEN-12005
U9 = TCA9546A:TCA9546APWR; MANUFACTURER_PART_NUMBER: TCA9546APWR; VENDOR: Texas Instruments
U10 = PCA9515ADP:PCA9515ADP,118: I2C-bus repeater; AVAILABILITY: Unavailable; DESCRIPTION: PCA9515A Series 2-Channel Bidirectional Buffer I2C-bus repeater - TSSOP - 8; MF: NXP USA; MP: PCA9515ADP,118; PACKAGE: TSSOP-8 NXP Semiconductors; PRICE: None
U11 = PIC16F506:PIC16F506-I/SL; MANUFACTURER_PART_NUMBER: PIC16F506ISL; VENDOR: Microchip
USB = 0533980471:0533980471
Y1 = ECS-10-13-1XH:ECS-10-13-1XH: Crystal HC49/U T/H; DESCRIPTION: Crystal 1MHz ±30ppm _Tol_ ±25ppm _Stability_ 13pF FUND 30Ohm 2-Pin HC-49/U Thru-Hole Bulk; DIGI-KEY_PART_NUMBER: X999-ND; DIGI-KEY_PURCHASE_URL: https://www.digikey.com/product-detail/en/ecs-inc/ECS-10-13-1XH/X999-ND/827491?utm_source=snapeda&utm_medium=aggregator&utm_campaign=symbol; MF: ECS Inc.; MP: ECS-10-13-1XH; PACKAGE: HC-49/U ECS International

## Net classes
1 power: width 0.254 mm